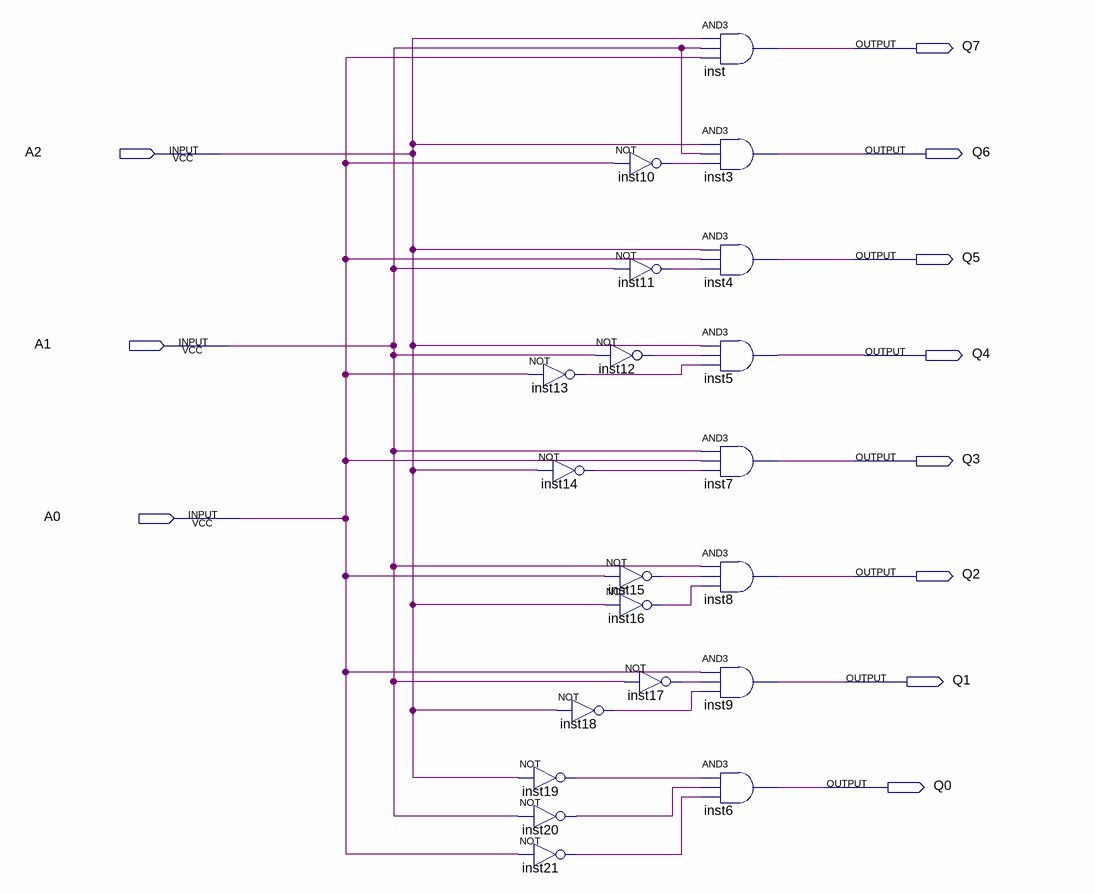
[diagram p0: schematic sheet]
// Quartus schematic 3-8.bdf as structural Verilog: 20 symbols, 11 pins
module \3-8  (
  input  A2,
  input  A1,
  input  A0,
  output Q7,
  output Q6,
  output Q5,
  output Q4,
  output Q3,
  output Q2,
  output Q1,
  output Q0
);

  wire inst10_out, inst11_out, inst12_out, inst13_out, inst14_out, inst15_out, inst16_out, inst17_out,
       inst18_out, inst19_out, inst20_out, inst21_out;

  not inst13 (inst13_out, A0);
  not inst14 (inst14_out, A2);
  not inst19 (inst19_out, A2);
  not inst20 (inst20_out, A1);
  not inst21 (inst21_out, A0);
  not inst10 (inst10_out, A0);
  not inst11 (inst11_out, A1);
  not inst12 (inst12_out, A1);
  not inst15 (inst15_out, A0);
  not inst16 (inst16_out, A2);
  not inst18 (inst18_out, A2);
  not inst17 (inst17_out, A1);
  and inst (Q7, A2, A1, A0);
  and inst3 (Q6, A2, A1, inst10_out);
  and inst4 (Q5, A2, A0, inst11_out);
  and inst5 (Q4, A2, inst12_out, inst13_out);
  and inst7 (Q3, A1, A0, inst14_out);
  and inst8 (Q2, A1, inst15_out, inst16_out);
  and inst9 (Q1, A0, inst17_out, inst18_out);
  and inst6 (Q0, inst19_out, inst20_out, inst21_out);
endmodule
